# Altium schematic sheet LV1.schdoc: Eurocard VME 3U (3.937 x 6.299 inches)
size A; Organization: Organization; Address1: Address1; Address2: Address2; Address3: Address3; Address4: Address4; DocumentNumber: 1; Revision: 0; SheetNumber: 2; SheetTotal: 2
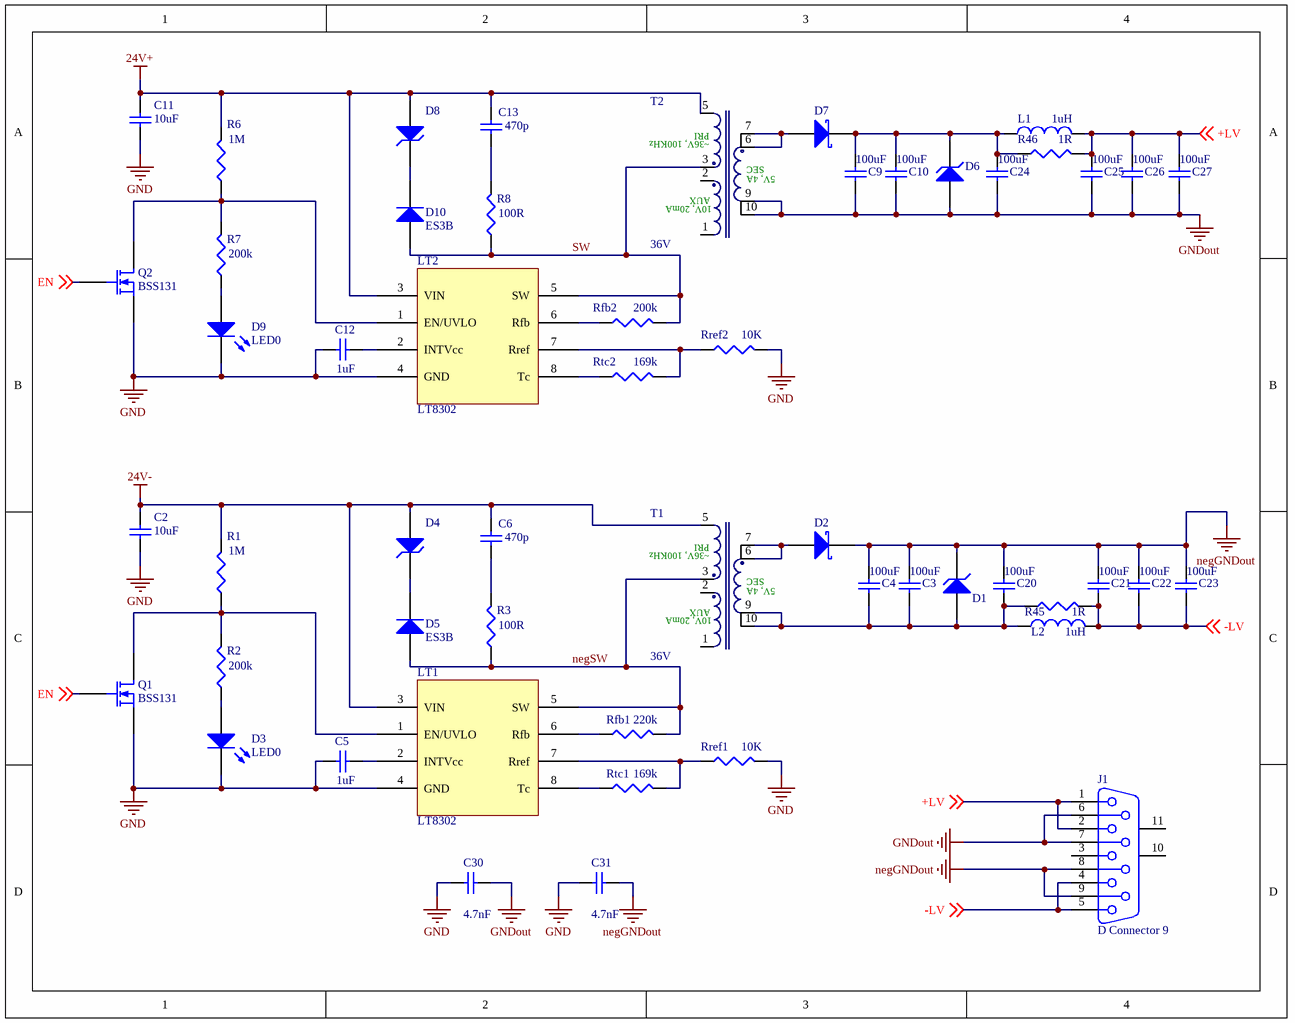
[diagram p0: LV1.schdoc]

## Parts
C2  value 10uF  [C1210]  (hidden comment: Cap Semi)
C3  value 100uF  [C1210]  (hidden comment: Cap Semi)
C4  value 100uF  [C1210]  (hidden comment: Cap Semi)
C5  value 1uF  [1608[0603]]  (hidden comment: Cap Semi)
C6  value 470p  [C0805]  (hidden comment: Cap Semi)
C9  value 100uF  [C1210]  (hidden comment: Cap Semi)
C10  value 100uF  [C1210]  (hidden comment: Cap Semi)
C11  value 10uF  [C1210]  (hidden comment: Cap Semi)
C12  value 1uF  [1608[0603]]  (hidden comment: Cap Semi)
C13  value 470p  [C0805]  (hidden comment: Cap Semi)
C20  value 100uF  [C1210]  (hidden comment: Cap Semi)
C21  value 100uF  [C1210]  (hidden comment: Cap Semi)
C22  value 100uF  [C1210]  (hidden comment: Cap Semi)
C23  value 100uF  [C1210]  (hidden comment: Cap Semi)
C24  value 100uF  [C1210]  (hidden comment: Cap Semi)
C25  value 100uF  [C1210]  (hidden comment: Cap Semi)
C26  value 100uF  [C1210]  (hidden comment: Cap Semi)
C27  value 100uF  [C1210]  (hidden comment: Cap Semi)
C30  value 4.7nF  [1812]  (hidden comment: Cap Semi)
C31  value 4.7nF  [1812]  (hidden comment: Cap Semi)
D1  BZT52H-B5V6  [SOD123F]  (value not drawn)
D2  PDS1040L  [PDS1040L]  (value not drawn)
D3  LED0  [LED-0]
D4  SMAJ30A  [DO-214AC]  (value not drawn)
D5  ES3B  [DO-214AB]
D6  BZT52H-B5V6  [SOD123F]  (value not drawn)
D7  PDS1040L  [PDS1040L]  (value not drawn)
D8  SMAJ30A  [DO-214AC]  (value not drawn)
D9  LED0  [LED-0]
D10  ES3B  [DO-214AB]
J1  D Connector 9  [DSUB1.385-2H9]
L1  value 1uH  [MPLC0730]  (hidden comment: Inductor)
L2  value 1uH  [MPLC0730]  (hidden comment: Inductor)
LT1  LT8302  [S8E]
LT2  LT8302  [S8E]
Q1  BSS131  [SOT-23]
Q2  BSS131  [SOT-23]
R1  value 1M  [J1-0603]  (hidden comment: Res3)
R2  value 200k  [J1-0603]  (hidden comment: Res3)
R3  value 100R  [C1206]  (hidden comment: Res3)
R6  value 1M  [J1-0603]  (hidden comment: Res3)
R7  value 200k  [J1-0603]  (hidden comment: Res3)
R8  value 100R  [C1206]  (hidden comment: Res3)
R45  value 1R  [J1-0603]  (hidden comment: Res3)
R46  value 1R  [J1-0603]  (hidden comment: Res3)
Rfb1  value 220k  [J1-0603]  (hidden comment: Res3)
Rfb2  value 200k  [J1-0603]  (hidden comment: Res3)
Rref1  value 10K  [J1-0603]  (hidden comment: Res3)
Rref2  value 10K  [J1-0603]  (hidden comment: Res3)
Rtc1  value 169k  [J1-0603]  (hidden comment: Res3)
Rtc2  value 169k  [J1-0603]  (hidden comment: Res3)
T1  36V  [EP13]
T2  36V  [EP13]

## Nets
24V+: C11.2 C13.2 D8.1(A) LT2.3(VIN) R6.2 T2.5
24V-: C2.2 C6.2 D4.1(A) LT1.3(VIN) R1.2 T1.5
GND: C2.1 C5.2 C11.1 C12.2 C30.1 C31.1 D3.2(K) D9.2(K) LT1.4(GND) LT2.4(GND) Q1.2(S) Q2.2(S) Rref1.2 Rref2.2
GNDout: C9.1 C10.1 C24.1 C25.1 C26.1 C27.1 C30.2 D6.1(A) J1.6 J1.7 T2.9 T2.10
negGNDout: C3.2 C4.2 C20.2 C21.2 C22.2 C23.2 C31.2 D1.2(K) D2.2(K) J1.8 J1.9
+LV: C25.2 C26.2 C27.2 J1.1 J1.2 L1.2 R46.2 ; off-sheet +LV
-LV: C21.1 C22.1 C23.1 J1.4 J1.5 L2.2 R45.2 ; off-sheet -LV
EN: Q1.1(G) Q2.1(G) ; off-sheet EN
negSW: D5.2(A) LT1.5(SW) R3.1 Rfb1.2 T1.3
SW: D10.2(A) LT2.5(SW) R8.1 Rfb2.2 T2.3
NetC3_1: C3.1 C4.1 C20.1 D1.1(A) L2.1 R45.1 T1.9 T1.10
NetC5_1: C5.1 LT1.2(INTVcc)
NetC6_1: C6.1 R3.2
NetC9_2: C9.2 C10.2 C24.2 D6.2(K) D7.2(K) L1.1 R46.1
NetC12_1: C12.1 LT2.2(INTVcc)
NetC13_1: C13.1 R8.2
NetD2_1: D2.1(A) T1.6 T1.7
NetD3_1: D3.1(A) R2.1
NetD4_2: D4.2(K) D5.1(K)
NetD7_1: D7.1(A) T2.6 T2.7
NetD8_2: D8.2(K) D10.1(K)
NetD9_1: D9.1(A) R7.1
NetLT1_1: LT1.1(EN/UVLO) Q1.3(D) R1.1 R2.2
NetLT1_6: LT1.6(Rfb) Rfb1.1
NetLT1_7: LT1.7(Rref) Rref1.1 Rtc1.2
NetLT1_8: LT1.8(Tc) Rtc1.1
NetLT2_1: LT2.1(EN/UVLO) Q2.3(D) R6.1 R7.2
NetLT2_6: LT2.6(Rfb) Rfb2.1
NetLT2_7: LT2.7(Rref) Rref2.1 Rtc2.2
NetLT2_8: LT2.8(Tc) Rtc2.1

Not connected (* = marked no-connect by the designer): J1 3 10(MH1) 11(MH2); T1 1 2; T2 1 2

## Notes on the sheet
- (in symbol WE-FB, 750311457) PRI; ~36V, 100KHz; SEC; 5V, 4A; AUX; 10V, 20mA

## Library data of the parts
C2 = Cap Semi: PartNo: UMK325BJ106KM-T; Published: 8-Jun-2000; LatestRevisionDate: 29-May-2009; LatestRevisionNote: IPC-7351 Footprint Added.; PackageReference: C1206; Publisher: Altium Limited; PackageDescription: Chip Capacitor
C3 C4 C9 C10 C20 C24 = Cap Semi: Capacitor (Semiconductor SIM Model); PartNo: C3225X5R0J107M250AC; Published: 8-Jun-2000; LatestRevisionDate: 29-May-2009; LatestRevisionNote: IPC-7351 Footprint Added.; PackageReference: C1206; Publisher: Altium Limited; PackageDescription: Chip Capacitor
C5 C12 = Cap Semi: Capacitor (Semiconductor SIM Model); PartNo: 06033D105KAT2A; Published: 8-Jun-2000; LatestRevisionDate: 29-May-2009; LatestRevisionNote: IPC-7351 Footprint Added.; PackageReference: C1206; Publisher: Altium Limited; PackageDescription: Chip Capacitor
C6 = Cap Semi: PartNo: 08055A221JAT2A; Published: 8-Jun-2000; LatestRevisionDate: 29-May-2009; LatestRevisionNote: IPC-7351 Footprint Added.; PackageReference: C1206; Publisher: Altium Limited; PackageDescription: Chip Capacitor
C11 = Cap Semi: Capacitor (Semiconductor SIM Model); PartNo: UMK325BJ106KM-T; Published: 8-Jun-2000; LatestRevisionDate: 29-May-2009; LatestRevisionNote: IPC-7351 Footprint Added.; PackageReference: C1206; Publisher: Altium Limited; PackageDescription: Chip Capacitor
C13 = Cap Semi: Capacitor (Semiconductor SIM Model); PartNo: 08055A221JAT2A; Published: 8-Jun-2000; LatestRevisionDate: 29-May-2009; LatestRevisionNote: IPC-7351 Footprint Added.; PackageReference: C1206; Publisher: Altium Limited; PackageDescription: Chip Capacitor
C21-C23 C25-C27 = Cap Semi: Capacitor (Semiconductor SIM Model); PartNo: CL32A107MPVNNNE; Published: 8-Jun-2000; LatestRevisionDate: 29-May-2009; LatestRevisionNote: IPC-7351 Footprint Added.; PackageReference: C1206; Publisher: Altium Limited; PackageDescription: Chip Capacitor
C30 C31 = Cap Semi: Capacitor (Semiconductor SIM Model); PartNo: C1812C472KDRACTU; Published: 8-Jun-2000; LatestRevisionDate: 29-May-2009; LatestRevisionNote: IPC-7351 Footprint Added.; PackageReference: C1206; Publisher: Altium Limited; PackageDescription: Chip Capacitor
D1 D6 = BZT52H-B5V6: Zener Diode; pin to pad: 1>2 2>1; Published: 8-Jun-2000; LatestRevisionDate: 17-Jul-2002; LatestRevisionNote: Re-released for DXP Platform.; PackageReference: DIODE-0.7; Publisher: Altium Limited; PackageDescription: Diode, Thru-Hole; 2 Leads; 0.7 in Pin Spacing; PartNo: BZT52H-B5V6
D2 D7 = PDS1040L: Schottky Diode; PartNo: PDS1040L-13; Published: 8-Jun-2000; LatestRevisionDate: 17-Jul-2002; LatestRevisionNote: Re-released for DXP Platform.; PackageReference: SMC; Publisher: Altium Limited; Code_JEDEC: DO-214-AA
D3 D9 = LED0: Typical INFRARED GaAs LED; Published: 8-Jun-2000; LatestRevisionDate: 08-Jul-2005; LatestRevisionNote: Mech Layer 1 removed.; PackageReference: LED-0; Publisher: Altium Limited; PackageDescription: LED; 2 Leads
D4 D8 = D Zener: Zener Diode; Published: 8-Jun-2000; LatestRevisionDate: 17-Jul-2002; LatestRevisionNote: Re-released for DXP Platform.; PackageReference: DIODE-0.7; Publisher: Altium Limited; PackageDescription: Diode, Thru-Hole; 2 Leads; 0.7 in Pin Spacing; PartNo: SMAJ30A
D5 D10 = ES3B: Power Diode; Note: Pin 2 is not connected and not drawn.; Published: 21-Mar-2003; LatestRevisionDate: 29-May-2009; LatestRevisionNote: IPC-7351 Footprint Added.; DatasheetVersion: Oct-1999; PackageVersion: Sep-2001; PackageReference: SOT-23; Publisher: Altium Limited; PackageDescription: 3-Pin SOT-23 Package 0.95 mm Pitch, 2.5 mm Lead Span; ComponentLink1Description: Manufacturer Link; ComponentLink1URL: http://www.infineon.com/; ComponentLink2Description: Datasheet; ComponentLink2URL: http://www.infineon.com/upload/Document/cmc_upload/documents/080/656/bas116series.pdf; PartNo: ES3B
J1 = D Connector 9: Receptacle Assembly, 9 Position, Right Angle; PartNo: 1734354-1; PackageDocument: O; Positions: 9; Published: 15-Jun-2001; LatestRevisionDate: 17-Jul-2002; LatestRevisionNote: Re-released for DXP Platform.; DatasheetDocument: 1-Sep-1999; PackageReference: 788750; Publisher: Altium Limited; Orientation: Right Angle; Gender: Receptacle
L1 L2 = Inductor: PartNo: MPLC0730L1R0; Code_IEC: 1005; Published: 8-Jun-2000; LatestRevisionDate: 29-May-2009; LatestRevisionNote: IPC-7351 Footprint Added.; PackageReference: 0402-A; Publisher: Altium Limited; PackageDescription: Chip Inductor; Code_JEITA: 0402
LT1 LT2 = LT8302: PartNo: LT8302ES8E#PBF
Q1 Q2 = BSS131: N-Channel MOSFET; Published: 8-Jun-2000; LatestRevisionDate: 17-Jul-2002; LatestRevisionNote: Re-released for DXP Platform.; PackageVersion: 1995/1996; PackageReference: E3; Publisher: Altium Limited; PackageDescription: TO, Flat Index; 3 In-Line, Axial Leads; Body Dia. 4.6mm; Lead Dia. 0.5 mm (max); PartNo: BSS131
R1-R3 R6-R8 R45 R46 Rfb1 Rfb2 Rref1 Rref2 Rtc1 Rtc2 = Res3: Resistor; Published: 8-Jun-2000; LatestRevisionDate: 29-May-2009; LatestRevisionNote: IPC-7351 Footprint Added.; PackageReference: J1-0603; Publisher: Altium Limited; PackageDescription: Chip Resistor
T1 = WE-FB, 750311457: Flyback Transformer; Manufacturer: Würth Elektronik eiSos GmbH; PartNo: 750311457; Ui: 36V; ComponentLink1Description: Manufacturer; ComponentLink1URL: http://www.we-online.de; Created by: Otto Christin; Created Date: OCT 2013; ComponentLink2Description: Datasheet; ComponentLink2URL: http://katalog.we-online.de/pbs/datasheet/750311457.pdf
T2 = WE-FB, 750311457: Flyback Transformer suitable or LT3573/ LT3574/ LT3575/ LT3748 WE-FB, Ui=36V; Manufacturer: Würth Elektronik eiSos GmbH; PartNo: 750311457; Ui: 36V; ComponentLink1Description: Manufacturer; ComponentLink1URL: http://www.we-online.de; Created by: Otto Christin; Created Date: OCT 2013; ComponentLink2Description: Datasheet; ComponentLink2URL: http://katalog.we-online.de/pbs/datasheet/750311457.pdf